# Altium schematic sheet capteur.SchDoc
size A4; SheetNumber: 3; SheetTotal: 11
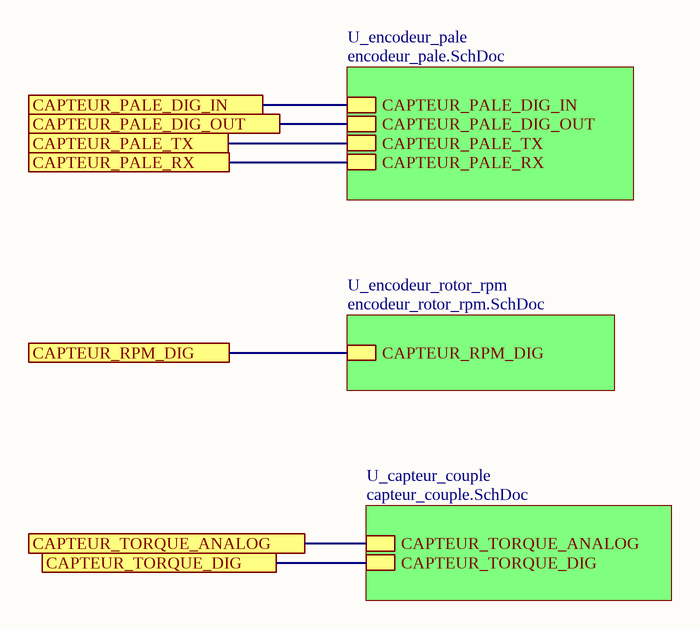
[diagram p0: capteur.SchDoc]

## Sub-sheets
U_capteur_couple = capteur_couple.SchDoc: CAPTEUR_TORQUE_ANALOG, CAPTEUR_TORQUE_DIG
U_encodeur_pale = encodeur_pale.SchDoc: CAPTEUR_PALE_DIG_IN, CAPTEUR_PALE_DIG_OUT, CAPTEUR_PALE_TX, CAPTEUR_PALE_RX
U_encodeur_rotor_rpm = encodeur_rotor_rpm.SchDoc: CAPTEUR_RPM_DIG

## Ports
CAPTEUR_PALE_DIG_IN, CAPTEUR_PALE_DIG_OUT, CAPTEUR_PALE_RX, CAPTEUR_PALE_TX, CAPTEUR_RPM_DIG, CAPTEUR_TORQUE_ANALOG, CAPTEUR_TORQUE_DIG

## Nets
CAPTEUR_PALE_DIG_IN: port CAPTEUR_PALE_DIG_IN, sheet U_encodeur_pale/CAPTEUR_PALE_DIG_IN
CAPTEUR_PALE_DIG_OUT: port CAPTEUR_PALE_DIG_OUT, sheet U_encodeur_pale/CAPTEUR_PALE_DIG_OUT
CAPTEUR_PALE_RX: port CAPTEUR_PALE_RX, sheet U_encodeur_pale/CAPTEUR_PALE_RX
CAPTEUR_PALE_TX: port CAPTEUR_PALE_TX, sheet U_encodeur_pale/CAPTEUR_PALE_TX
CAPTEUR_RPM_DIG: port CAPTEUR_RPM_DIG, sheet U_encodeur_rotor_rpm/CAPTEUR_RPM_DIG
CAPTEUR_TORQUE_ANALOG: port CAPTEUR_TORQUE_ANALOG, sheet U_capteur_couple/CAPTEUR_TORQUE_ANALOG
CAPTEUR_TORQUE_DIG: port CAPTEUR_TORQUE_DIG, sheet U_capteur_couple/CAPTEUR_TORQUE_DIG